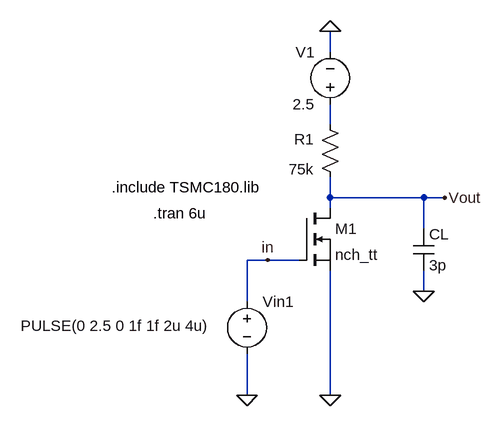
[diagram p0: schematic q5c.asc]
q5c.asc, the LTspice schematic file:
Version 4
SHEET 1 880 680
WIRE 256 -96 256 -128
WIRE 256 16 256 -16
WIRE 256 128 256 96
WIRE 400 128 256 128
WIRE 432 128 400 128
WIRE 256 144 256 128
WIRE 400 176 400 128
WIRE 160 224 128 224
WIRE 208 224 160 224
WIRE 400 272 400 240
WIRE 128 288 128 224
WIRE 128 432 128 368
WIRE 256 432 256 240
FLAG 256 432 0
FLAG 256 -128 0
FLAG 432 128 Vout
FLAG 400 272 0
FLAG 160 224 in
FLAG 128 432 0
SYMBOL nmos 208 144 R0
SYMATTR InstName M1
SYMATTR Value nch_tt
SYMATTR Value2 l=180n w=270n
SYMBOL voltage 128 272 R0
WINDOW 123 0 0 Left 0
WINDOW 39 0 0 Left 0
WINDOW 3 -348 53 Left 2
SYMATTR InstName Vin1
SYMATTR Value PULSE(0 2.5 0 1f 1f 2u 4u)
SYMBOL res 240 0 R0
WINDOW 0 -39 38 Left 2
WINDOW 3 -48 84 Left 2
SYMATTR InstName R1
SYMATTR Value 75k
SYMBOL voltage 256 0 R180
WINDOW 0 24 96 Left 2
WINDOW 3 24 16 Left 2
WINDOW 123 0 0 Left 0
WINDOW 39 0 0 Left 0
SYMATTR InstName V1
SYMATTR Value 2.5
SYMBOL cap 384 176 R0
SYMATTR InstName CL
SYMATTR Value 3p
TEXT -80 112 Left 2 !.include TSMC180.lib
TEXT -16 152 Left 2 !.tran 6u

The netlist it stands for:
* q5c.asc
M1 Vout in 0 0 nch_tt l=180n w=270n
Vin1 in 0 PULSE(0 2.5 0 1f 1f 2u 4u)
R1 N001 Vout 75k
V1 N001 0 2.5
CL Vout 0 3p
.model NMOS NMOS
.model PMOS PMOS
.lib standard.mos
.include TSMC180.lib
.tran 6u
.backanno
.end

* Results of the author's LTspice run, read from the files saved beside the schematic
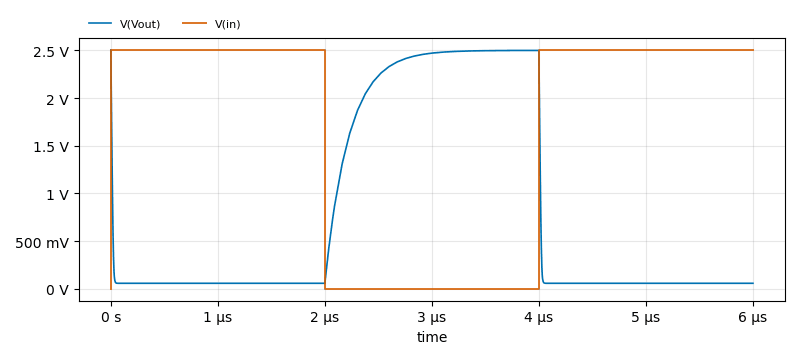
[diagram p1: Transient Analysis of q5c.asc, plotted from the saved traces]
* Transient Analysis, 1 run:
*   V(Vout): min 57.56 mV, max 2.5 V, average 790.6 mV, rms 1.325 V, last 57.82 mV
*   V(in): min 0 V, max 2.5 V, average 1.667 V, rms 2.041 V, last 2.5 V